# Altium schematic sheet Connectors.SchDoc
size 431 x 279 mm; SheetNumber: 2; SheetTotal: 6; ENG_APP_DATE: --/--/--; DSN_APP_DATE: --/--/--; CHK_APP_DATE: --/--/--
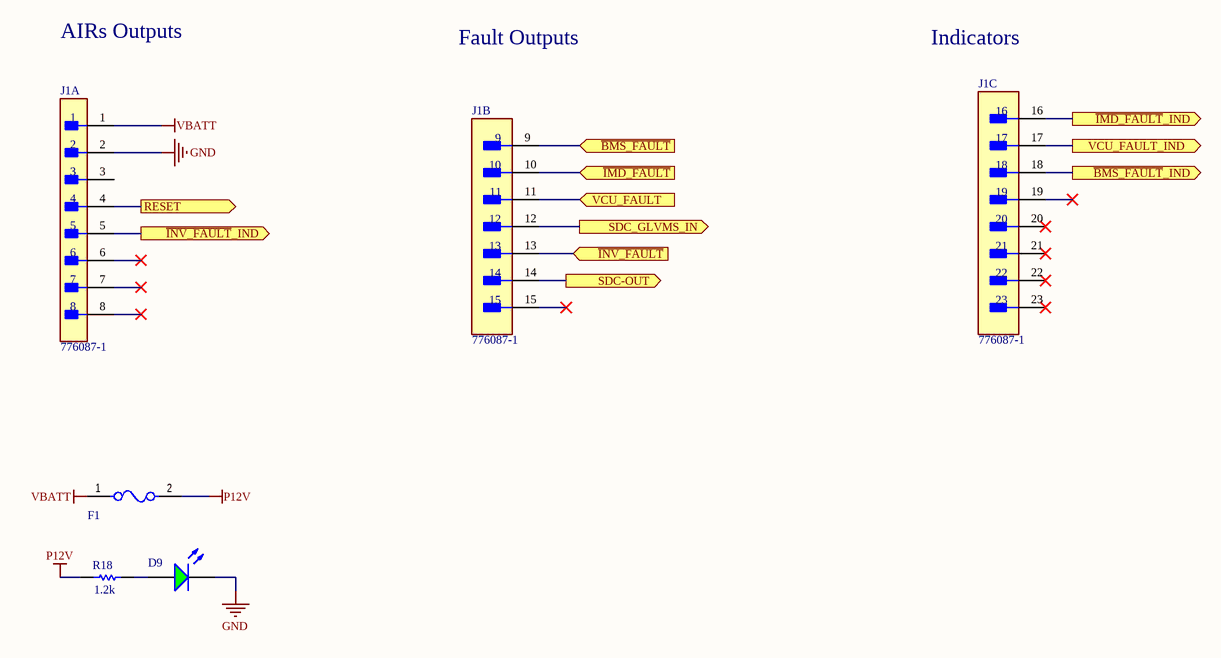
[diagram p0: Connectors.SchDoc]

## Parts
D9  597-3311-407F  [DIAL-597-3311-407F_V]  (value not drawn)
F1  0468001.NRHF  [FP-437-MFG]  (value not drawn)
J1  776087-1  [FP-776087-1-MFG]  (parts A,B,C of 3)
R18  1.2k  [RESC3216X70X50LL05T20]

## Ports
RESET (out), SDC-OUT (out), SDC_GLVMS_IN (out), VCU_FAULT (in), VCU_FAULT_IND (out), ~{BMS_FAULT} (in), ~{BMS_FAULT}_IND (out), ~{IMD_FAULT} (in), ~{IMD_FAULT}_IND (out), ~{INV_FAULT} (in), ~{INV_FAULT}_IND (out)

## Nets
GND: D9.2(K) J1.2
P12V: F1.2 R18.1
VBATT: F1.1 J1.1
~{BMS_FAULT}: J1.9 ; port ~{BMS_FAULT}
~{BMS_FAULT}_IND: J1.18 ; port ~{BMS_FAULT}_IND
~{IMD_FAULT}: J1.10 ; port ~{IMD_FAULT}
~{IMD_FAULT}_IND: J1.16 ; port ~{IMD_FAULT}_IND
~{INV_FAULT}: J1.13 ; port ~{INV_FAULT}
~{INV_FAULT}_IND: J1.5 ; port ~{INV_FAULT}_IND
RESET: J1.4 ; port RESET
SDC-OUT: J1.14 ; port SDC-OUT
SDC_GLVMS_IN: J1.12 ; port SDC_GLVMS_IN
VCU_FAULT: J1.11 ; port VCU_FAULT
VCU_FAULT_IND: J1.17 ; port VCU_FAULT_IND
NetD9_1: D9.1(A) R18.2

Not connected (* = marked no-connect by the designer): J1 3 6* 7* 8* 15* 19* 20* 21* 22* 23*

## Notes on the sheet
- AIRs Outputs
- Fault Outputs
- Indicators
- 8
- 7
- 6
- 5
- 4
- 3
- DWG. NO.
- REV.
- SHT.
- 2
- 1
- THIS DOCUMENT AND THE DATA DISCLOSED HEREIN OR HEREWITH IS THE PROPERTY OF ALTIUM LIMITED AND MAY BE FREELY DISTRIBUTED IN WHOLE. NO RIGHTS ARE RESERVED OR EXPRESS OR IMPLIED WARANTEE GIVEN.
- REVISION
- DESCRIPTION
- DATE
- APPROVED
- F
- E
- D
- C
- B
- ENG:
- APPROVALS
- PROJECT
- SUITE 200
- 2175 SALK AVENUE
- CARLSBAD, CA 92008
- A
- DSN:
- CHK:
- REFERENCE DOCUMENTS
- PROJECT REVISION:
- TITLE
- DOCUMENT REVISION:
- DESIGN ITEM:
- USA
- BOM:
- FAB DWG:
- PCB DWG:
- ASSY DWG:
- SCALE:
- SIZE
- CAGE CODE
- FILE NAME
- DWG NO.
- SHEET
- OF
- REV

## Library data of the parts
D9 = CMP-2000-05651-1: LED Green, 75 mW, 30 mA, -30 to 85 degC, 2-Pin SMD, RoHS, Tape and Reel; Manufacturer: Dialight; Product Depth (mm): 1.5mm; Viewing Angle: 70deg; DELETED: Compliant; Number of  Elements: 1; Emitting Color: YellowGreen; Shape Type: Rectangular; Product Length (mm): 3mm; Forward Current: 30mA; Main Category: ChipLED; Luminous Intensity: 7.5mcd; Type: Uni-Color; High Brightness: No; Test Current (It): 20mA; Lens Type: NonDiffused; Reverse Voltage: 4V; Peak Wavelength: 560nm; Power Dissipation: 75W; Forward Voltage: 2.5V; Chip Material: GaP; Mounting: SurfaceMount; Product Height (mm): 1.5mm; Pin Count: 2; Datasheet URL: https://datasheet.ciiva.com/15117/getdatasheetpartid-142484-15117764.pdf; Mounting Technology: SurfaceMount; Rad Hardened: No; Operating Temperature Classification: Commercial; Lens Dimensions: 2x1.5x0.9mm; Operating Temp Range: -30Cto85C; Package Reference: 597-3311-407F; Package Type: SMD; Datasheet Version: 07/2002; Lum Intensity: 7.5mcd; Packaging: TapeandReel; Package Description: 2-Pin Surface Mount Device, Body 1.5 x 3 mm; Manufacturer URL: http://www.dialight.com/
F1 = CMP-08605-000049-1: FUSE BRD MNT 1A 32VAC 35VDC 1206; Manufacturer: Littelfuse Inc; Manufacturer Part Number: 0437003.WR; Fuse Interrupt Ac Current: 50A; Value: 0.033Ω; Fuse Blow Speed: Fast; Voltage Rating: 32V; Fuse Current: 3A; Max Fuse Dc Voltage: 35V; Fuse I2T: 0.506A2Sec; Fuse Voltage Drop: 0.14V; Octopart: https://octopart.com/0437003.wr-littelfuse-8600121; Category: Fuse; Fuse Interrupt Dc Current: 50A; Temperature: -55°C to +150°C; Device Class L1: Circuit Protection; Temperature Range High: +150°C; Temperature Range Low: -55°C; Resistance: 0.033Ω; Automotive: No; ComponentLink2URL: https://www.littelfuse.com/~/media/electronics/datasheets/fuses/littelfuse_fuse_437_datasheet.pdf.pdf; Ipc Land Pattern Name: CAPC320163X82; Mouser Description: Surface Mount Fuses 32V FA 1206 3A; Device Class L2: Fuses; Device Class L3: unset; Package: 437; RoHS: TRUE; Height: 0.8639mm; Digikey Description: FUSE BRD MNT 3A 32VAC 35VDC 1206; ComponentLink2Description: Datasheet; Lead Free: Yes; Max Fuse Ac Voltage: 32V
J1 = CMP-03369-000157-2: CONN HEADER R/A 23POS 4MM; Max Voltage Rating (AC): 250V; PCB Thickness: 0.062inch; PCB Mount Alignment: Yes (With); Primary Type: Rectangular; Number of Signal Positions: 23; Row Spacing: 0.157inch; Current Rating: 17A; Connector System: Wire-to-Device; Number of Ports: 1; Shielding: Unshielded; PCB Mount Retention: With; Circuit Application: Power; Tab Thickness: 1.3mm; Gender: Male; Contact Shape: Circular; Mount: Through Hole; ELV: Compliant; Orientation: Right Angle; Lead Free: Lead Free; Contact Plating: Tin; Package Quantity: 1; RoHS Compliant: Yes; Connector Type: Header; Series: Ampseal; Termination: Solder; Voltage Rating (AC): 250V; Contact Material: Brass; Number of Rows: 3; Depth: 37.9mm; Housing Material: Polybutylene; Fastening Type: Ramp; Width: 37.9mm; Flammability Rating: UL94 V-0; Housing Color: Black; Radiation Hardening: No; Contact Type: Male Pin; Sealable: Yes (With); Length: 60.8mm; Max Operating Temperature: 221°C; Packaging: Bulk; Number of Positions: 23; Insulation Material: PBT; Pitch: 0.157inch; Contact Finish - Mating: TIN; Color: Black; Number of Terminals/Pins: 23; Insulation Color: Black; Number of Contacts: 23; Min Operating Temperature: -40°C
R18 = CMP-2003-00061-1: ERJ8ENF1201V; Manufacturer: Panasonic; Part Number: ERJ8ENF1201V